# Altium project epc9600ioextend.PrjPcb
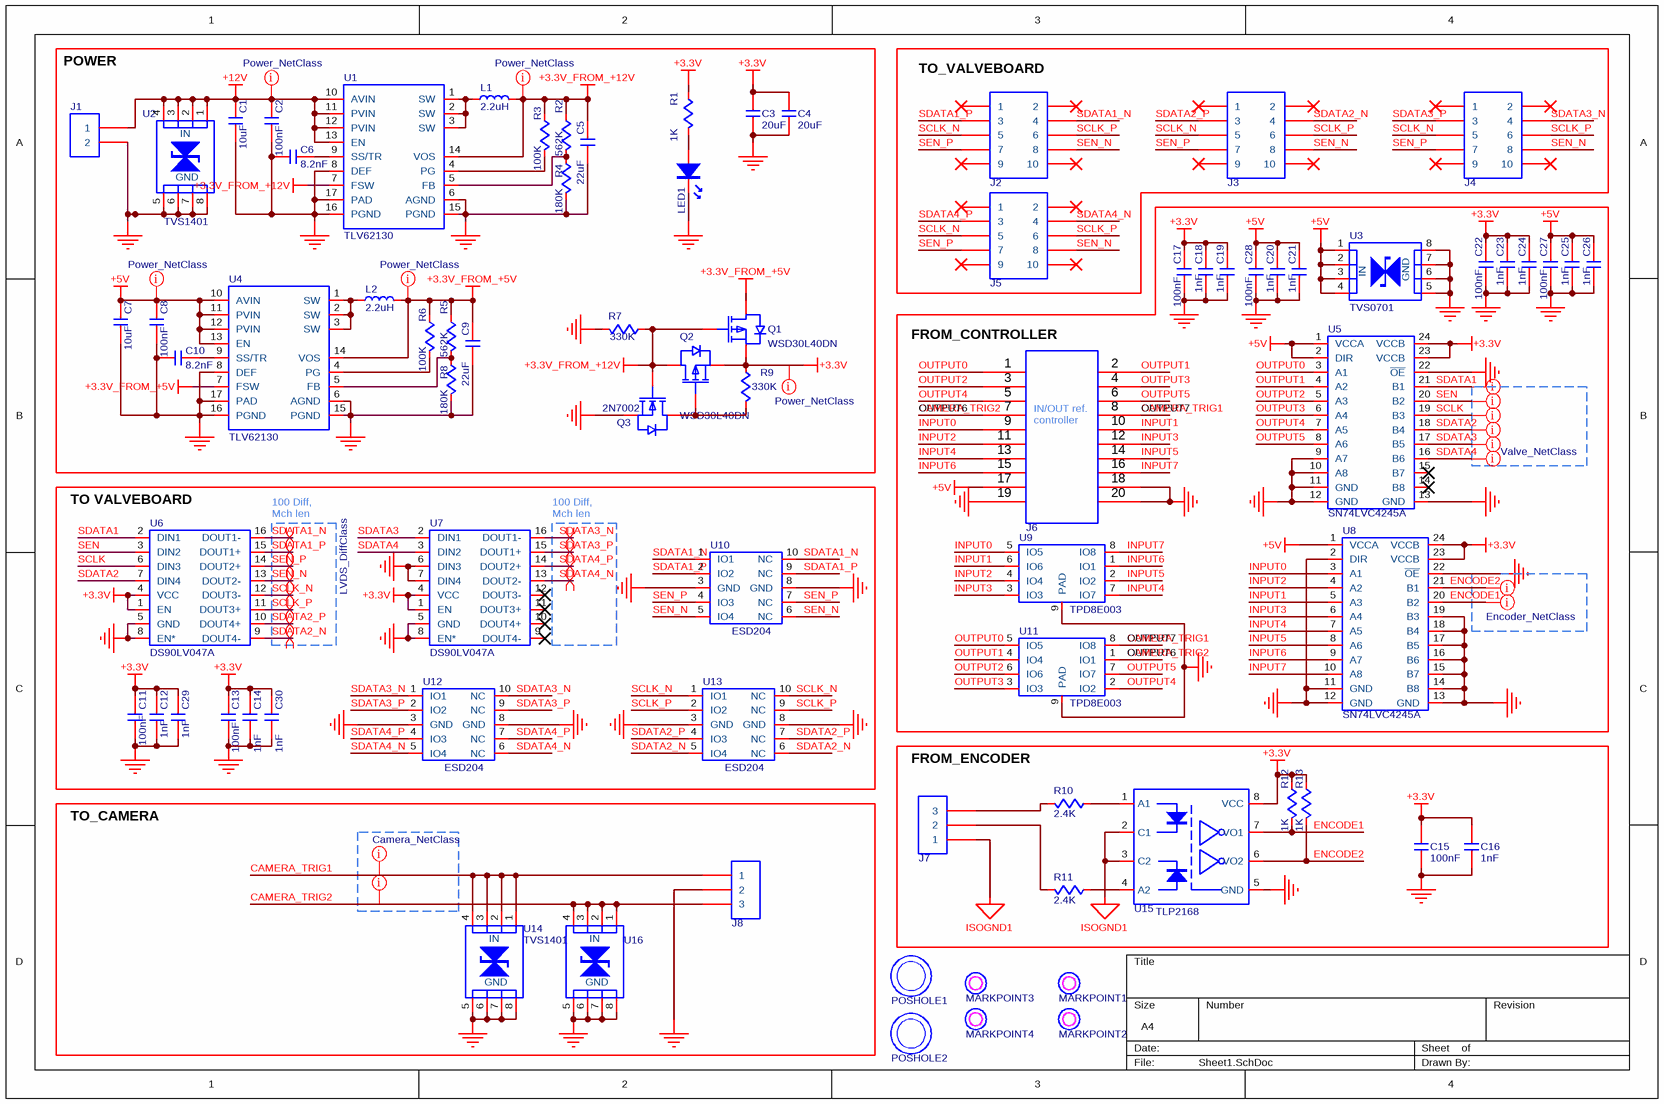
[diagram p0: Sheet1.SchDoc]
1 sheet, 79 parts. Net scope: global (net labels, ports and power ports of the same name join across sheets).
Board file: PCB1.PcbDoc

## Sheet Sheet1.SchDoc: VALVEBOARD MODULE CMOS_TO_LVDS
size A4; Date: 2021/12/7; CheckedBy: DINGKUN; Author: DINGKUN; SheetNumber: 1; SheetTotal: 1; Time: 15:44

### Parts
C1  value 10uF  [C0805]  (hidden comment: C-NOMO)
C2  value 100nF  [C0402]  (hidden comment: C-NOMO)
C3  value 20uF  [C0805]  (hidden comment: C-NOMO)
C4  value 20uF  [C0805]  (hidden comment: C-NOMO)
C5  value 22uF  [C0805]  (hidden comment: C-NOMO)
C6  value 8.2nF  [C0402]  (hidden comment: C-NOMO)
C7  value 10uF  [C0805]  (hidden comment: C-NOMO)
C8  value 100nF  [C0402]  (hidden comment: C-NOMO)
C9  value 22uF  [C0805]  (hidden comment: C-NOMO)
C10  value 8.2nF  [C0402]  (hidden comment: C-NOMO)
C11  value 100nF  [C0402]  (hidden comment: C-NOMO)
C12  value 1nF  [C0402]  (hidden comment: C-NOMO)
C13  value 100nF  [C0402]  (hidden comment: C-NOMO)
C14  value 1nF  [C0402]  (hidden comment: C-NOMO)
C15  value 100nF  [C0402]  (hidden comment: C-NOMO)
C16  value 1nF  [C0402]  (hidden comment: C-NOMO)
C17  value 100nF  [C0402]  (hidden comment: C-NOMO)
C18  value 1nF  [C0402]  (hidden comment: C-NOMO)
C19  value 1nF  [C0402]  (hidden comment: C-NOMO)
C20  value 1nF  [C0402]  (hidden comment: C-NOMO)
C21  value 1nF  [C0402]  (hidden comment: C-NOMO)
C22  value 100nF  [C0402]  (hidden comment: C-NOMO)
C23  value 1nF  [C0402]  (hidden comment: C-NOMO)
C24  value 1nF  [C0402]  (hidden comment: C-NOMO)
C25  value 1nF  [C0402]  (hidden comment: C-NOMO)
C26  value 1nF  [C0402]  (hidden comment: C-NOMO)
C27  value 100nF  [C0402]  (hidden comment: C-NOMO)
C28  value 100nF  [C0402]  (hidden comment: C-NOMO)
C29  value 1nF  [C0402]  (hidden comment: C-NOMO)
C30  value 1nF  [C0402]  (hidden comment: C-NOMO)
J1  HDR1X2  [KF301-5.0-2P]  (value not drawn)
J2  HDR2X5  [HDR2X5-NJ]  (value not drawn)
J3  HDR2X5  [HDR2X5-NJ]  (value not drawn)
J4  HDR2X5  [HDR2X5-NJ]  (value not drawn)
J5  HDR2X5  [HDR2X5-NJ]  (value not drawn)
J6  HDR2X10  [HDR2X10-NJ]  (value not drawn)
J7  HDR1X3  [KF301-5.0-3P]  (value not drawn)
J8  HDR1X3  [KF301-5.0-3P]  (value not drawn)
L1  value 2.2uH  [FXL0624]  (hidden comment: L)
L2  value 2.2uH  [FXL0624]  (hidden comment: L)
LED1  LED  [LED0603]  (value not drawn)
MARKPOINT1  MARKPOINT  [MARKPOINT-1.0]  (value not drawn)
MARKPOINT2  MARKPOINT  [MARKPOINT-1.0]  (value not drawn)
MARKPOINT3  MARKPOINT  [MARKPOINT-1.0]  (value not drawn)
MARKPOINT4  MARKPOINT  [MARKPOINT-1.0]  (value not drawn)
POSHOLE1  POSHOLE  [POSHOLE-3.2]  (value not drawn)
POSHOLE2  POSHOLE  [POSHOLE-3.2]  (value not drawn)
Q1  WSD30L40DN  [WSD30L40DN]
Q2  WSD30L40DN  [WSD30L40DN]
Q3  2N7002  [2N7002]
R1  value 1K  [R0402]  (hidden comment: R)
R2  value 562K  [R0402]  (hidden comment: R)
R3  value 100K  [R0402]  (hidden comment: R)
R4  value 180K  [R0402]  (hidden comment: R)
R5  value 562K  [R0402]  (hidden comment: R)
R6  value 100K  [R0402]  (hidden comment: R)
R7  value 330K  [R0402]  (hidden comment: R)
R8  value 180K  [R0402]  (hidden comment: R)
R9  value 330K  [R0402]  (hidden comment: R)
R10  value 2.4K  [R2512]  (hidden comment: R)
R11  value 2.4K  [R2512]  (hidden comment: R)
R12  value 1K  [R0402]  (hidden comment: R)
R13  value 1K  [R0402]  (hidden comment: R)
U1  TLV62130  [TLV62130]
U2  TVS1401  [TVS1401]
U3  TVS0701  [TVS0701]
U4  TLV62130  [TLV62130]
U5  SN74LVC4245A  [SN74LVC4245A]
U6  DS90LV047A  [DS90LV047]
U7  DS90LV047A  [DS90LV047]
U8  SN74LVC4245A  [SN74LVC4245A]
U9  TPD8E003  [TPD8E003]
U10  ESD204  [ESD204]
U11  TPD8E003  [TPD8E003]
U12  ESD204  [ESD204]
U13  ESD204  [ESD204]
U14  TVS1401  [TVS1401]
U15  TLP2168  [TLP2168]
U16  TVS1401  [TVS1401]  (value not drawn)

### Blocks framed on the sheet
POWER: C1-C10 J1 L1 L2 LED1 Q1-Q3 R1-R9 U1 U2 U4
TO_VALVEBOARD: J2-J5
FROM_CONTROLLER: C17-C28 J6 U3 U5 U8 U9 U11
TO VALVEBOARD: C11-C14 C29 C30 U6 U7 U10 U12 U13
FROM_ENCODER: C15 C16 J7 R10-R13 U15
TO_CAMERA: J8 U14 U16

### Nets
+3.3V: C3.2 C4.2 C11.2 C12.2 C13.2 C14.2 C15.2 C16.2 C17.2 C18.2 C19.2 C22.2 C23.2 C24.2 C29.2 C30.2 Q1.S Q2.S R1.2 R9.2 R12.2 R13.2 U5.23(VCCB) U5.24(VCCB) U6.1(EN) U6.4(VCC) U7.1(EN) U7.4(VCC) U8.23(VCCB) U8.24(VCCB) U15.8(VCC)
+3.3V_FROM_+5V: C9.1 L2.2 Q1.D R5.2 R6.2 U4.7(FSW) U4.14(VOS)
+3.3V_FROM_+12V: C5.1 L1.2 Q1.G Q2.D Q3.G R2.2 R3.2 R7.2 U1.7(FSW) U1.14(VOS)
+5V: C7.2 C8.2 C20.2 C21.2 C25.2 C26.2 C27.2 C28.2 J6.17 U3.1(IN) U3.2(IN) U3.3(IN) U3.4(IN) U4.10(AVIN) U4.11(PVIN) U4.12(PVIN) U4.13(EN) U5.1(VCCA) U5.2(DIR) U8.1(VCCA)
+12V: C1.2 C2.2 J1.1 U1.10(AVIN) U1.11(PVIN) U1.12(PVIN) U1.13(EN) U2.1(IN) U2.2(IN) U2.3(IN) U2.4(IN)
DGND: C1.1 C2.1 C3.1 C4.1 C5.2 C6.2 C7.1 C8.1 C9.2 C10.2 C11.1 C12.1 C13.1 C14.1 C15.1 C16.1 C17.1 C18.1 C19.1 C20.1 C21.1 C22.1 C23.1 C24.1 C25.1 C26.1 C27.1 C28.1 C29.1 C30.1 J1.2 J6.18 J6.19 J6.20 J8.2 LED1.1 Q3.S R4.1 R7.1 R8.1 U1.6(AGND) U1.8(DEF) U1.15(PGND) U1.16(PGND) U1.17(PAD) U2.5(GND) U2.6(GND) U2.7(GND) U2.8(GND) U3.5(GND) U3.6(GND) U3.7(GND) U3.8(GND) U4.6(AGND) U4.8(DEF) U4.15(PGND) U4.16(PGND) U4.17(PAD) U5.9(A7) U5.10(A8) U5.11(GND) U5.12(GND) U5.13(GND) U5.22(~{OE}) U6.5(GND) U6.8(EN*) U7.5(GND) U7.6(DIN3) U7.7(DIN4) U7.8(EN*) U8.2(DIR) U8.11(GND) U8.12(GND) U8.13(GND) U8.14(B8) U8.15(B7) U8.16(B6) U8.17(B5) U8.18(B4) U8.19(B3) U8.22(~{OE}) U9.9(PAD) U10.3(GND) U10.8(GND) U11.9(PAD) U12.3(GND) U12.8(GND) U13.3(GND) U13.8(GND) U14.5(GND) U14.6(GND) U14.7(GND) U14.8(GND) U15.5(GND) U16.5(GND) U16.6(GND) U16.7(GND) U16.8(GND)
ISOGND1: J7.1 U15.2(C1) U15.3(C2)
CAMERA_TRIG1: J6.8 J8.1 U11.8(IO8) U14.1(IN) U14.2(IN) U14.3(IN) U14.4(IN)
CAMERA_TRIG2: J6.7 J8.3 U11.1(IO1) U16.1(IN) U16.2(IN) U16.3(IN) U16.4(IN)
ENCODE1: R12.1 U8.20(B2) U15.7(VO1)
ENCODE2: R13.1 U8.21(B1) U15.6(VO2)
INPUT0: J6.9 U8.3(A1) U9.5(IO5)
INPUT1: J6.10 U8.5(A3) U9.6(IO6)
INPUT2: J6.11 U8.4(A2) U9.4(IO4)
INPUT3: J6.12 U8.6(A4) U9.3(IO3)
INPUT4: J6.13 U8.7(A5) U9.7(IO7)
INPUT5: J6.14 U8.8(A6) U9.2(IO2)
INPUT6: J6.15 U8.9(A7) U9.1(IO1)
INPUT7: J6.16 U8.10(A8) U9.8(IO8)
OUTPUT0: J6.1 U5.3(A1) U11.5(IO5)
OUTPUT1: J6.2 U5.4(A2) U11.4(IO4)
OUTPUT2: J6.3 U5.5(A3) U11.6(IO6)
OUTPUT3: J6.4 U5.6(A4) U11.3(IO3)
OUTPUT4: J6.5 U5.7(A5) U11.2(IO2)
OUTPUT5: J6.6 U5.8(A6) U11.7(IO7)
SCLK: U5.19(B3) U6.6(DIN3)
SCLK_N: J2.5 J3.5 J4.5 J5.5 U6.12(DOUT3-) U13.1(IO1) U13.10(NC)
SCLK_P: J2.6 J3.6 J4.6 J5.6 U6.11(DOUT3+) U13.2(IO2) U13.9(NC)
SDATA1: U5.21(B1) U6.2(DIN1)
SDATA1_N: J2.4 U6.16(DOUT1-) U10.1(IO1) U10.10(NC)
SDATA1_P: J2.3 U6.15(DOUT1+) U10.2(IO2) U10.9(NC)
SDATA2: U5.18(B4) U6.7(DIN4)
SDATA2_N: J3.4 U6.9(DOUT4-) U13.5(IO4) U13.6(NC)
SDATA2_P: J3.3 U6.10(DOUT4+) U13.4(IO3) U13.7(NC)
SDATA3: U5.17(B5) U7.2(DIN1)
SDATA3_N: J4.4 U7.16(DOUT1-) U12.1(IO1) U12.10(NC)
SDATA3_P: J4.3 U7.15(DOUT1+) U12.2(IO2) U12.9(NC)
SDATA4: U5.16(B6) U7.3(DIN2)
SDATA4_N: J5.4 U7.13(DOUT2-) U12.5(IO4) U12.6(NC)
SDATA4_P: J5.3 U7.14(DOUT2+) U12.4(IO3) U12.7(NC)
SEN: U5.20(B2) U6.3(DIN2)
SEN_N: J2.8 J3.8 J4.8 J5.8 U6.13(DOUT2-) U10.5(IO4) U10.6(NC)
SEN_P: J2.7 J3.7 J4.7 J5.7 U6.14(DOUT2+) U10.4(IO3) U10.7(NC)
NetC6_1: C6.1 U1.9(SS/TR)
NetC10_1: C10.1 U4.9(SS/TR)
NetJ7_2: J7.2 R11.1
NetJ7_3: J7.3 R10.1
NetL1_1: L1.1 U1.1(SW) U1.2(SW) U1.3(SW)
NetL2_1: L2.1 U4.1(SW) U4.2(SW) U4.3(SW)
NetLED1_2: LED1.2 R1.1
NetQ2_G: Q2.G Q3.D R9.1
NetR2_1: R2.1 R4.2 U1.5(FB)
NetR3_1: R3.1 U1.4(PG)
NetR5_1: R5.1 R8.2 U4.5(FB)
NetR6_1: R6.1 U4.4(PG)
NetR10_2: R10.2 U15.1(A1)
NetR11_2: R11.2 U15.4(A2)

Not connected (* = marked no-connect by the designer): J2 1* 2* 9* 10*; J3 1* 2* 9* 10*; J4 1* 2* 9* 10*; J5 1* 2* 9* 10*; U5 14(B8)* 15(B7)*; U7 9(DOUT4-)* 10(DOUT4+)* 11(DOUT3+)* 12(DOUT3-)*

### Layout directives
differential pair; differential pair class LVDS_DiffClass: SCLK_N, SCLK_P, SDATA1_N, SDATA1_P, SDATA2_N, SDATA2_P, SDATA3_N, SDATA3_P, SDATA4_N, SDATA4_P, SEN_N, SEN_P
net class Power_NetClass: +3.3V, +3.3V_FROM_+5V, +3.3V_FROM_+12V, +5V, +12V
net class Encoder_NetClass: ENCODE1, ENCODE2
net class Valve_NetClass: SCLK, SDATA1, SDATA2, SDATA3, SDATA4, SEN
net class Camera_NetClass: CAMERA_TRIG1, CAMERA_TRIG2

### Notes on the sheet
- OUTPUT6
- (near J6) OUTPUT7
- (near J6) IN/OUT ref. controller
- (near U6) 100 Diff, Mch len
- (near U7) 100 Diff, Mch len
- (near U11) OUTPUT6
- (near U11) OUTPUT7

### Library data of the parts
C1-C30 = C-NOMO: voltage: 25V; precision: 5%
L1 L2 = L: Code_IEC: 1005; Published: 8-Jun-2000; LatestRevisionDate: 29-May-2009; LatestRevisionNote: IPC-7351 Footprint Added.; PackageReference: 0402-A; Publisher: Altium Limited; PackageDescription: Chip Inductor; Code_JEITA: 0402
R1-R13 = R: precision: 1%
J1 = HDR1X2: Supplier 1: LCSC; Supplier Part Number 1: C474881; Supplier 2: LCSC; Supplier Part Number 2: C225477; Supplier 3: LCSC; Supplier Part Number 3: C20079
J2-J5 = HDR2X5: Supplier 1: LCSC; Supplier Part Number 1: C225520; Supplier 2: LCSC; Supplier Part Number 2: C5665
J6 = HDR2X10: Supplier 1: LCSC; Supplier Part Number 1: C124359; Supplier 2: LCSC; Supplier Part Number 2: C3405
J7 J8 = HDR1X3: Supplier 1: LCSC; Supplier Part Number 1: C474884; Supplier 2: LCSC; Supplier Part Number 2: C609572
Q3 = 2N7002: Supplier 1: LCSC; Supplier Part Number 1: C725128
U1 U4 = TLV62130: Supplier 1: LCSC; Supplier Part Number 1: C122479
U2 U14 U16 = TVS1401: Supplier 1: LCSC; Supplier Part Number 1: C1849891
U3 = TVS0701: Supplier 1: LCSC; Supplier Part Number 1: C2873147
U5 U8 = SN74LVC4245A: Supplier 1: LCSC; Supplier Part Number 1: C7859
U6 U7 = DS90LV047A: Supplier Part Number 1: C87097; Supplier 1: LCSC
U9 U11 = TPD8E003: Supplier 1: LCSC; Supplier Part Number 1: C2867469
U10 U12 U13 = ESD204: Supplier 1: LCSC; Supplier Part Number 1: C553132